# EAGLE design Pulse Oximeter Board (EAGLE 9.4.0)
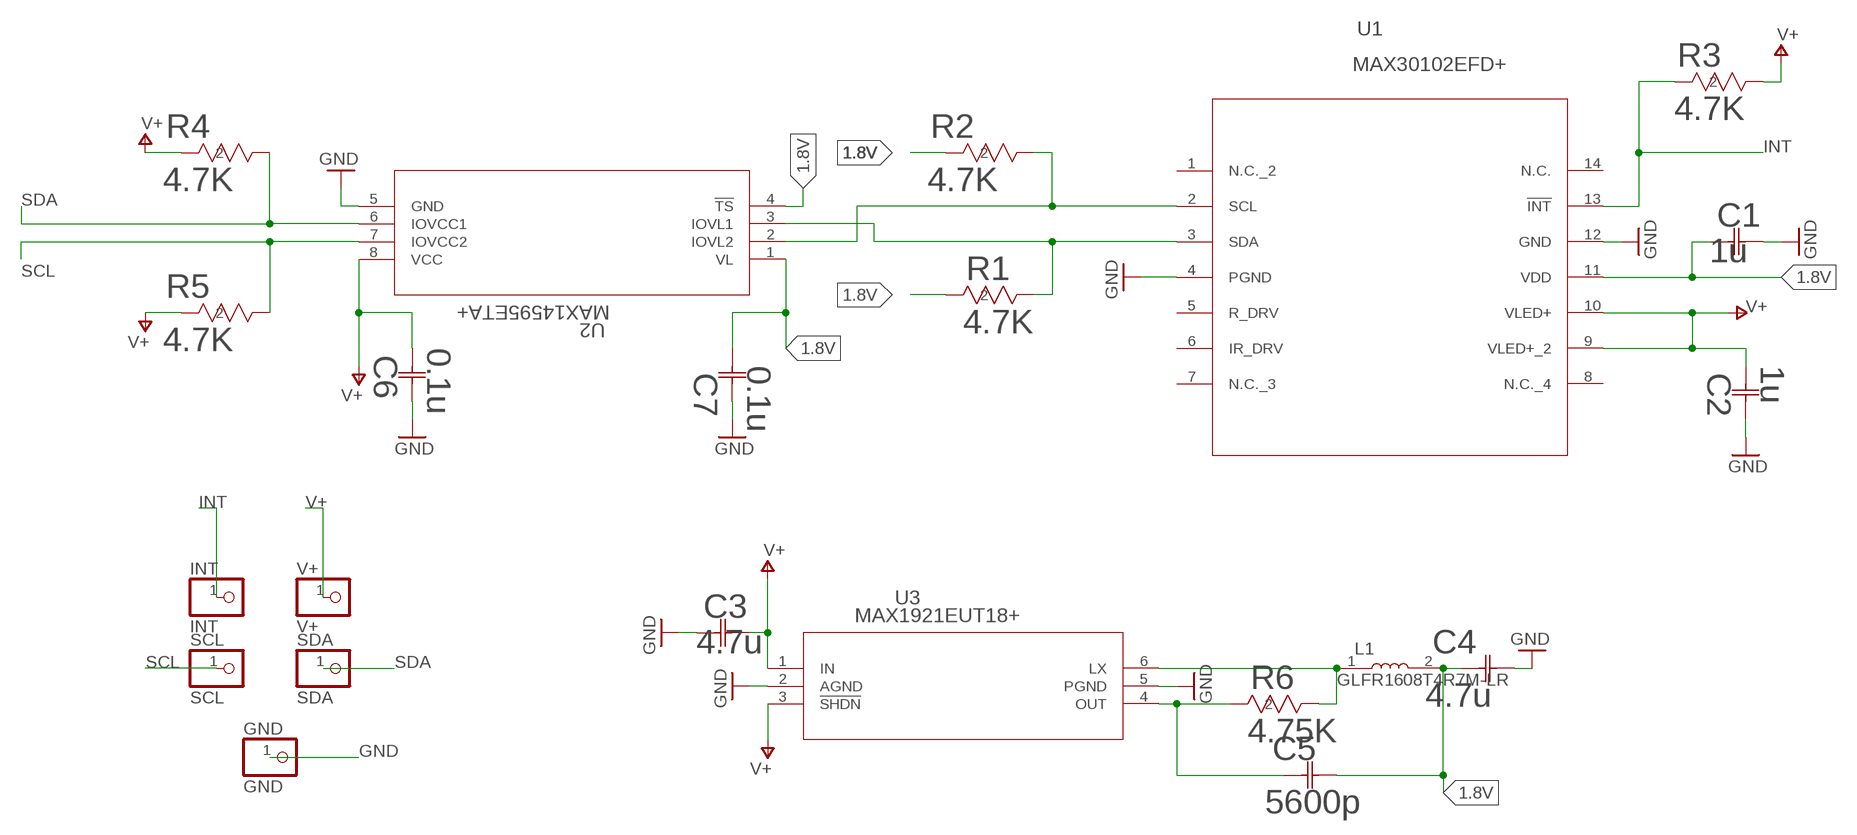
[diagram p0: schematic, sheet 1]

## Parts
C1  1u  GRM155R61A105KE15D  [CAP_CHIP2_1X0P5]
C2  1u  GRM155R61A105KE15D  [CAP_CHIP2_1X0P5]
C3  4.7u  GRM155R61A105KE15D  [CAP_CHIP2_1X0P5]
C4  4.7u  GRM155R61A105KE15D  [CAP_CHIP2_1X0P5]
C5  5600p  GRM155R61A105KE15D  [CAP_CHIP2_1X0P5]
C6  0.1u  GRM155R61A105KE15D  [CAP_CHIP2_1X0P5]
C7  0.1u  GRM155R61A105KE15D  [CAP_CHIP2_1X0P5]
GND  GND  PINHD-1X1  [1X01]
INT  INT  PINHD-1X1  [1X01]
L1  GLFR1608T4R7M-LR  [INDC1608X95N]
R1  4.7K  CRG0402J1K0/10  [RES0402_CRG_TYCO]
R2  4.7K  CRG0402J1K0/10  [RES0402_CRG_TYCO]
R3  4.7K  CRG0402J1K0/10  [RES0402_CRG_TYCO]
R4  4.7K  CRG0402J1K0/10  [RES0402_CRG_TYCO]
R5  4.7K  CRG0402J1K0/10  [RES0402_CRG_TYCO]
R6  4.75K  CRG0402J1K0/10  [RES0402_CRG_TYCO]
SCL  SCL  PINHD-1X1  [1X01]
SDA  SDA  PINHD-1X1  [1X01]
U1  MAX30102EFD+  [21-0880B]
U2  MAX14595ETA+  [21-0487A]
U3  MAX1921EUT18+  [21-0058I]
V+  V+  PINHD-1X1  [1X01]

## Nets
1.8V: C1.1 C4.1 C5.2 C7.1 L1.2 R1.2 R2.2 U1.11(VDD) U2.1(VL) U2.4(!TS)
GND: C1.2 C2.2 C3.1 C4.2 C6.2 C7.2 GND.1 U1.4(PGND) U1.12(GND) U2.5(GND) U3.2(AGND) U3.5(PGND)
INT: INT.1 R3.2 U1.13(!INT)
N$1: R2.1 U1.2(SCL) U2.2(IOVL2)
N$2: L1.1 R6.1 U3.6(LX)
N$3: R1.1 U1.3(SDA) U2.3(IOVL1)
N$7: C5.1 R6.2 U3.4(OUT)
SCL: R5.1 SCL.1 U2.7(IOVCC2)
SDA: R4.1 SDA.1 U2.6(IOVCC1)
V+: C2.1 C3.2 C6.1 R3.1 R4.2 R5.2 U1.9(VLED+_2) U1.10(VLED+) U2.8(VCC) U3.1(IN) U3.3(!SHDN) V+.1
Unconnected: U1.1(N.C._2) U1.5(R_DRV) U1.6(IR_DRV) U1.7(N.C._3) U1.8(N.C._4) U1.14(N.C.)

## Library data of the parts
C1-C7 = 0402 footprint capacitor:GRM155R61A105KE15D; MANUFACTURER_PART_NUMBER: GRM155R61A105KE15D; VENDOR: Murata
GND INT SCL SDA V+ = pinhead:PINHD-1X1: PIN HEADER
L1 = GLFR1608T4R7M-LR:GLFR1608T4R7M-LR: Inductor Power Chip Shielded Wirewound 4.7uH 20% 500mA 240mOhm DCR 0603 T/R; DESCRIPTION: GLFR Series 0603 4.7 uH ±20 % Tol. 0.24 Ohm DCR 110 mA Shielded Power Inductor; DIGI-KEY_PART_NUMBER: 445-3607-1-ND; DIGI-KEY_PURCHASE_URL: https://www.digikey.co.uk/product-detail/en/tdk-corporation/GLFR1608T4R7M-LR/445-3607-1-ND/1856575?utm_source=snapeda&utm_medium=aggregator&utm_campaign=symbol; MF: TDK; MP: GLFR1608T4R7M-LR; PACKAGE: 0603 TDK
R1-R6 = 0402 footprint :CRG0402J1K0/10; MANUFACTURER_PART_NUMBER: CRG0402J1K010; VENDOR: TE Connectivity
U1 = MAX30102EFD+:MAX30102EFD+; MANUFACTURER_PART_NUMBER: MAX30102EFD+; VENDOR: Maxim Integrated Products
U2 = MAX14595ETA+:MAX14595ETA+; MANUFACTURER_PART_NUMBER: MAX14595ETA+; VENDOR: Maxim Integrated Products
U3 = MAX1921EUT18+:MAX1921EUT18+; MANUFACTURER_PART_NUMBER: MAX1921EUT18+; VENDOR: Maxim Integrated Products

## Board
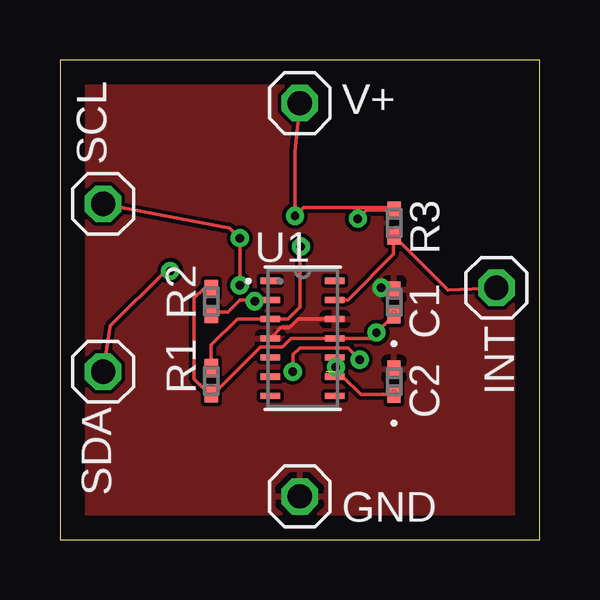
[diagram p1: board, top side]
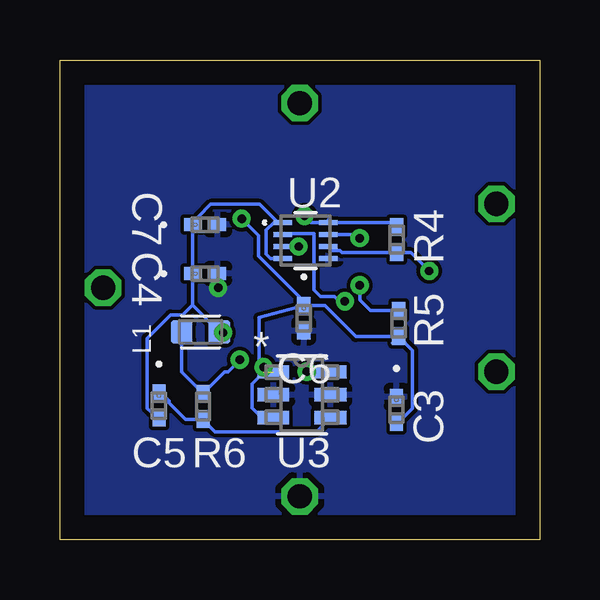
[diagram p2: board, bottom side, seen from below]

Size 20 x 20 mm. Coordinates in mm from the lower left corner, seen from the top.
Outline: 0,0 20,0 20,20 0,20 0,0
Copper layers (1*16): Top 0.035mm / dielectric 1.5mm / Bottom 0.035mm
Design rules "default": minimum track width 6mil, minimum drill 0.35mm, track to track 6mil, track to pad 6mil, pad to pad 6mil, via to via 6mil, smd to smd 6mil, copper to edge 40mil, drill to drill 6mil, minimum pad ring 10mil, minimum via ring 8mil, stop-mask expansion 4mil, vias tented up to drill 0mil, thermal gap 10mil

### Footprints (pad centres in the part's own frame; a part is rotated, then mirrored left to right if it is on the bottom)
CAP_CHIP2_1X0P5 = smd 0.706 x 0.55: 1 -0.528,0; 2 0.528,0
1X01 = drill 1.016 octagon: 1 0,0
INDC1608X95N = smd 0.9 x 0.97: 1 -0.785,0; 2 0.785,0
RES0402_CRG_TYCO = smd 0.711 x 0.559: 1 -0.546,0; 2 0.546,0
21-0880B = smd 0.813 x 0.254: 1 -1.346,2.4; 2 -1.346,1.6; 3 -1.346,0.8; 4 -1.346,0; 5 -1.346,-0.8; 6 -1.346,-1.6; 7 -1.346,-2.4; 8 1.346,-2.4; 9 1.346,-1.6; 10 1.346,-0.8; 11 1.346,0; 12 1.346,0.8; 13 1.346,1.6; 14 1.346,2.4
21-0487A = smd 0.762 x 0.203: 1 -0.953,0.75; 2 -0.953,0.25; 3 -0.953,-0.25; 4 -0.953,-0.75; 5 0.953,-0.75; 6 0.953,-0.25; 7 0.953,0.25; 8 0.953,0.75
21-0058I = smd 1.321 x 0.559: 1 -1.194,0.95; 2 -1.194,0; 3 -1.194,-0.95; 4 1.194,-0.95; 5 1.194,0; 6 1.194,0.95

### Placement (x,y rotation side)
C1  13.93,9.89 90 top
C2  13.93,6.58 90 top
C3  5.97,5.41 270 bottom
C4  13.95,11.09 0 bottom
C5  15.87,5.59 270 bottom
C6  9.83,9.23 270 bottom
C7  13.95,13.13 0 bottom
GND  10,1.8 0 top
INT  18.2,10.5 0 top
L1  14.14,8.66 0 bottom
R1  6.31,6.62 270 top
R2  6.31,9.93 90 top
R3  13.93,13.2 270 top
R4  5.95,12.51 90 bottom
R5  5.87,9.01 270 bottom
R6  14.03,5.55 270 bottom
SCL  1.8,14 0 top
SDA  1.8,7 0 top
U1  10.12,8.39 0 top
U2  9.76,12.47 0 bottom
U3  9.91,6.04 0 bottom
V+  10,18.2 0 top

### Tracks (layer width: path | path; a pad name or v marks a point on that pad's centre or on a via)
1.8V  (via drill 0.35)
  Top 0.152: R2.2 6,10.48 5.6,10.08 5.6,6.7 6.27,6.03 R1.2 6.56,6.33 6.65,6.33 8.36,8.03 9.28,8.03 9.63,8.39 U1.11 13.2,8.39 v13.2,8.63 C1.1
  Bottom 0.152: 14.48,9.78 L1.2 13.33,8.63 v13.2,8.63 | 14.48,9.78 C4.1 14.48,13 | 14.48,13 C7.1 14.23,13.38 14.23,13.47 13.71,13.99 11.67,13.99 10.9,13.22 U2.1 11.08,13.22 11.4,12.9 11.4,11.9 11.22,11.72 U2.4 | 14.48,9.78 14.89,9.37 15.39,9.37 16.37,8.39 16.37,5.48 16.21,5.31 16.12,5.31 C5.2 | 14.4,13 14.48,13
GND  (via drill 0.35)
  Top 0.152: C1.2 13.4,10.42 v13.4,10.5 | U1.4 9.22,8.83 9.57,8.83 9.93,9.19 U1.12
  Bottom 0.152: v13.4,10.5 13.4,11.07 C4.2
  pour Bottom: -1.2,-0.1 -1.2,21.9 20.7,21.9 21.5,21.1 21.5,-0.2 21.1,-0.6 -0.7,-0.6
  pour Top: -1.3,20.8 19.7,20.8 21.6,18.9 21.6,0 21,-0.6 -0.6,-0.6 -1.3,0.1
INT
  Top 0.152: U1.13 arc-90 U1.13 12,10 13.9,11.9 13.9,12.62 R3.2 16.18,10.4 INT.1
N$1  (via drill 0.35)
  Top 0.152: R2.1 6.43,9.5 7,9.5 7.5,10 8.1,10 8.11,9.99 U1.2 8.17,9.99 v8.12,9.94
  Bottom 0.152: U2.2 10.68,12.75 9.4,12.75 9.4,10.4 9.13,10.13 8.55,10.13 8.36,9.94 v8.12,9.94
N$2  (via drill 0.35)
  Top 0.152: v12.5,7.5 12,8 10,8 9.71,7.71 v9.71,7
  Bottom 0.152: L1.1 14.93,6.99 R6.1 13.13,7 13,7 v12.5,7.5 | v9.71,7 U3.6
N$3  (via drill 0.35)
  Top 0.152: R1.1 6.31,8.11 7.4,9.2 U1.3 9.5,9.19 10,9.69 10,12.18 v10.04,12.22
  Bottom 0.152: v10.04,12.22 U2.3
N$7
  Bottom 0.152: C5.1 15.62,5.87 15.53,5.87 15.44,5.78 15.44,5.69 14.76,5 R6.2 13.53,4.5 9.31,4.5 U3.4
SCL  (via drill 0.35)
  Top 0.152: v7.5,10.61 v7.5,12.57 7.07,13 SCL.1
  Bottom 0.152: R5.1 7.06,9.56 7.5,10 v7.5,10.61 | v7.5,12.57 7.65,12.72 U2.7
SDA  (via drill 0.35)
  Top 0.152: SDA.1 2.1,8.9 4.4,11.2 v4.6,11.2
  Bottom 0.152: U2.6 8.64,12.05 8.33,12.05 8.25,11.96 R4.1 5.36,11.96 v4.6,11.2
V+  (via drill 0.35)  (1 unrouted)
  Top 0.152: R3.1 13.82,13.85 10.15,13.85 v9.8,13.5 9.8,16.2 V+.1 | C2.1 12.55,6.05 11.81,6.79 U1.9 | U1.9 U1.10 | U1.9 11.5,6.83 v11.5,7.19 | v12.42,13.38 12.79,13.75 R3.1 | R3.1 13.25,13.75
  Bottom 0.152: R4.2 arc-90 6.11,13.22 U2.8 | U2.8 8.81,13.35 | U3.3 11.19,5 11.5,5 12,5.5 12,6.49 11.5,6.99 v11.5,7.19 11.7,7.39 11.7,9.26 C6.1 | R5.2 5.3,7.89 5.3,5.46 5.63,5.13 5.72,5.13 C3.2 | v9.8,13.5 9.52,13.22 U2.8 | v12.42,13.38 11.72,12.68 11.72,11.82 9.83,9.93 C6.1 | R5.2 6.13,8.2 | R5.2 7.66,8.46 8.96,9.76 C6.1